# EAGLE design DHJSNoiseConsole (EAGLE 6.6.0)
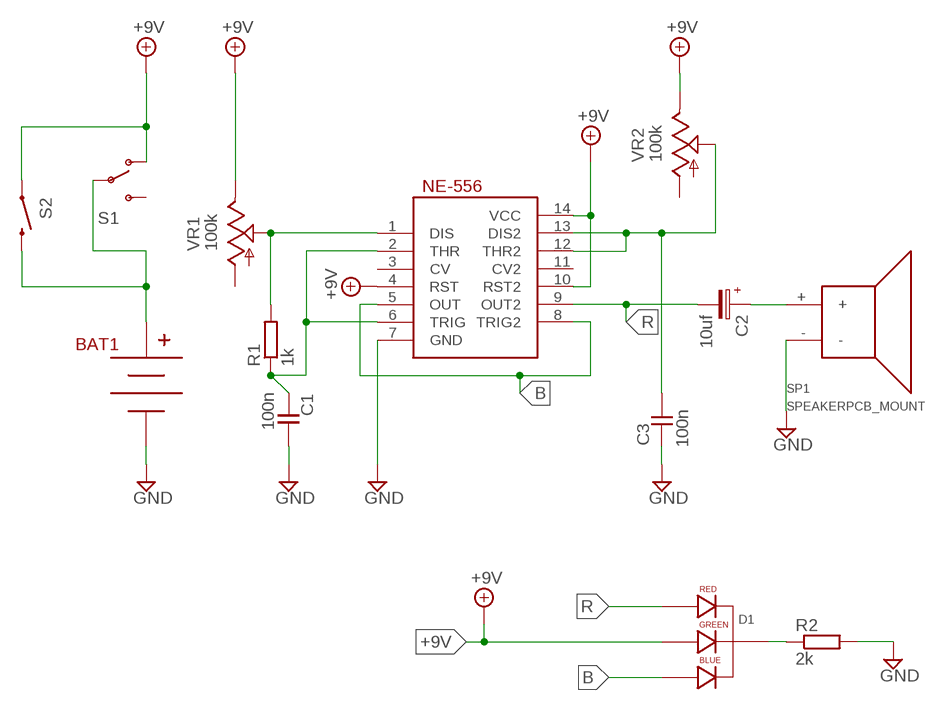
[diagram p0: schematic, sheet 1]

## Parts
BAT1  BC9VPC  [BC9VPC]
C1  100n  C-EU050-024X044  [C050-024X044]
C2  10uf  050-EU  [050_020]
C3  100n  C-EU050-024X044  [C050-024X044]
D1  LED-RGB-CC-THRUCLEAR  [LED-RGB-THRU]
NE-556  556  [DIL14]
R1  1k  RESISTOR10MM_RESISTOR  [10MM_RESISTOR]
R2  2k  RESISTOR10MM_RESISTOR  [10MM_RESISTOR]
S1  SWITCH-SPDTPTH  [SWITCH-SPDT]
S2  SWITCH-MOMENTARY-2SIDE_EZ  [TACTILE-PTH-SIDEEZ]
SP1  SPEAKERPCB_MOUNT  [PCB_MOUNT_SPEAKER]
VR1  100k  9MM_SNAP-IN_POT_  [9MM_SNAP-IN_POT]
VR2  100k  9MM_SNAP-IN_POT_  [9MM_SNAP-IN_POT]

## Nets
+9V: D1.3(GREEN_CATHODE) NE-556.4(RST) NE-556.10(RST2) NE-556.14(VCC) S1.1(O) S2.1 VR1.3(E) VR2.3(E)
B: D1.4(BLUE_CATHODE) NE-556.5(OUT) NE-556.8(TRIG2)
GND: BAT1.V- C1.1 C3.2 NE-556.7(GND) R2.2 SP1.-
N$1: NE-556.1(DIS) R1.2 VR1.2(S)
N$2: BAT1.V+ S1.2(P) S2.2
N$3: C3.1 NE-556.12(THR2) NE-556.13(DIS2) VR2.2(S)
N$4: D1.2(CATHODE) R2.1
N$6: C1.2 NE-556.2(THR) NE-556.6(TRIG) R1.1
N$7: C2.+ SP1.+
R: C2.- D1.1(RED_CATHODE) NE-556.9(OUT2)
Unconnected: NE-556.3(CV) NE-556.11(CV2) S1.3(S) VR1.1(A) VR2.1(A)

## Library data of the parts
BAT1 = SparkFun-Connectors:BC9VPC: 9V board-mount battery cradle; PROD_ID: BATT-10855
C1 C3 = TomW:C-EU: CAPACITOR, European symbol
C2 = gm-caps-electro-pol:050-EU
D1 = SparkFun-LED:LED-RGB-CC-THRU: RGB Through-hole common cathode LED SparkFun Storefront: COM-00105 (Clear) COM-09264 (Diffuse); PROD_ID: DIO-08418
NE-556 = SparkFun-AnalogIC:556: Dual timer circuit (2 555 timers in one package)
R1 R2 = MusicThingModular:RESISTOR: Standard resistor, various versions
S1 = SparkFun-Electromechanical:SWITCH-SPDT: SPDT Switch Simple slide switch, Spark Fun Electronics SKU : COM-00102 DPDT SMT slide switch, AYZ0202, SWCH-08179
S2 = SparkFun-Electromechanical:SWITCH-MOMENTARY-2: Various NO switches- pushbuttons, reed, etc
SP1 = SparkFun-Electromechanical:SPEAKER: General speakers.; MFG: SANCO; PROD_#: NA; SKU: COM-11089; SPARKLE_ID: 6504
VR1 VR2 = MusicThingModular:9MM_SNAP-IN_POT: 9mm vertical snap-in pot, Alpha / Panasonic style

## Net classes
0 default: width 0.61 mm

## Board
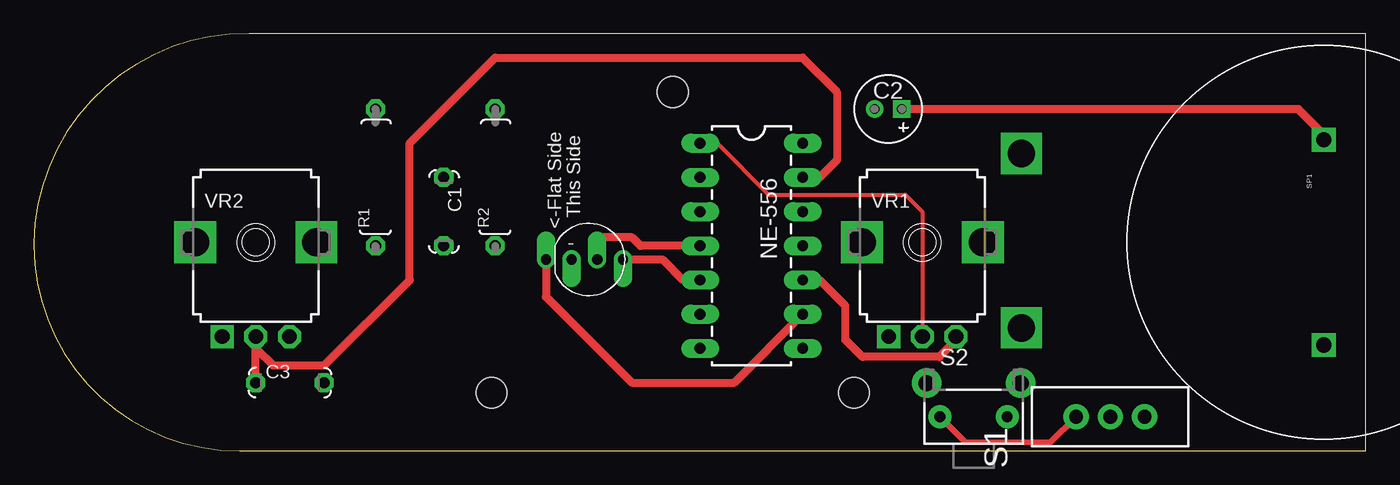
[diagram p1: board, top side]
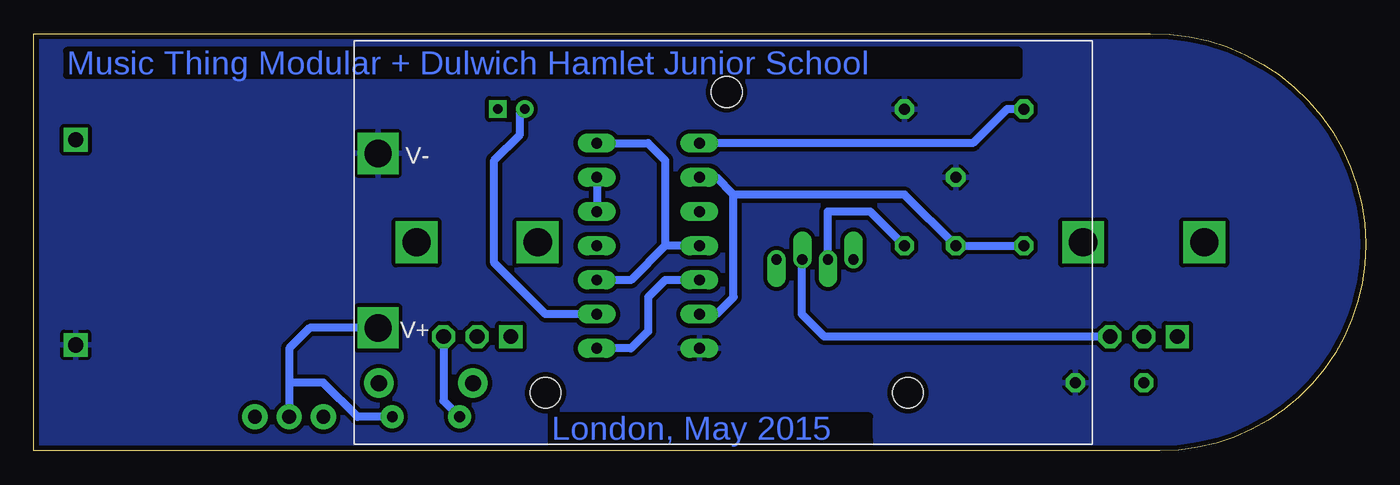
[diagram p2: board, bottom side, seen from below]

Size 99 x 31 mm. Coordinates in mm from the lower left corner, seen from the top.
Outline: 99,31 16.01,31 arc90 0,15.41 0,15.29 arc90 15.29,0 99,0 99,31
Copper layers (1*2*15*16): Top 0.035mm / dielectric 0.2mm / Route2 0.0175mm / dielectric 1.1mm / Route15 0.0175mm / dielectric 0.2mm / Bottom 0.035mm
Design rules "MT design rules rev2": minimum track width 6mil, minimum drill 12mil, track to track 12mil, track to pad 12mil, pad to pad 10mil, via to via 10mil, smd to smd 0mil, copper to edge 15mil, drill to drill 13mil, minimum pad ring 12mil, minimum via ring 6mil, stop-mask expansion 2mil, vias tented up to drill 25mil, thermal gap 10mil

### Footprints (pad centres in the part's own frame; a part is rotated, then mirrored left to right if it is on the bottom)
BC9VPC = drill 2.032 square: V+ 53.086,21.336; V- 53.086,8.382 | hole 2.286: 27.178,3.81; 13.716,26.162; 40.64,26.162
C050-024X044 = drill 0.813 octagon: 1 -2.54,0; 2 2.54,0
050_020 = drill 0.7 square: + -1,0 | drill 0.7: - 1,0
LED-RGB-THRU = drill 0.762 pad 0.889 offset: 1 3.175,0; 2 1.27,0; 3 -0.635,0; 4 -2.54,0
DIL14 = drill 0.813 long: 1 -8.89,-3.81; 2 -6.35,-3.81; 3 -3.81,-3.81; 4 -1.27,-3.81; 5 1.27,-3.81; 6 3.81,-3.81; 7 6.35,-3.81; 8 6.35,3.81; 9 3.81,3.81; 10 1.27,3.81; 11 -1.27,3.81; 12 -3.81,3.81; 13 -6.35,3.81; 14 -8.89,3.81
10MM_RESISTOR = drill 0.813 octagon: 1 -5.08,0; 2 5.08,0
SWITCH-SPDT = drill 1.016 pad 1.88: 1 0,2.54; 2 0,0; 3 0,-2.54
TACTILE-PTH-SIDEEZ = drill 0.8 pad 1.7: 1 -2.5,0; 2 2.5,0 | drill 1.2 pad 2.2: ANCHOR1 -3.5,2.5; ANCHOR2 3.5,2.5
PCB_MOUNT_SPEAKER = drill 1.143 square: + -7.62,0; - 7.62,0
9MM_SNAP-IN_POT = drill 1.1 pad 1.676 square: 1 -2.5,-7 | drill 1.1 pad 1.676 octagon: 2 0,-7; 3 2.5,-7 | drill 2.1 pad 2.8 square: M1 4.5,0; M2 -4.5,0

### Placement (x,y rotation side)
BAT1  20.32,30.48 180 bottom
C1  30.48,17.78 270 top
C2  63.5,25.4 180 top
C3  19.05,5.08 0 top
D1  41.25,14.23 180 top
NE-556  53.34,13.97 270 top
R1  25.4,20.32 90 top
R2  34.29,20.32 90 top
S1  80.01,2.54 90 top
S2  69.85,2.54 0 top
SP1  95.88,15.5 270 top
U$1  [MTM_1CM_KEEPOUT]  91.44,11.43 0 bottom
VR1  66.04,15.5 0 top
VR2  16.51,15.5 0 top

### Tracks (layer width: path | path; a pad name or v marks a point on that pad's centre or on a via)
+9V
  Top 0.406: S1.1 75.56,0.64 69.25,0.64 S2.1
  Top 0.61: NE-556.4 45.09,15.24 44.45,15.88 41.91,15.88 41.91,14.26 D1.3 | VR1.3 68.54,8.21 67.31,6.99 61.59,6.99 60.33,8.26 60.33,10.79 58.42,12.7 NE-556.10
  Bottom 0.61: VR1.3 68.54,3.73 S2.1 | NE-556.4 52.07,15.24 | 52.07,15.24 54.61,12.7 NE-556.10 | NE-556.14 53.34,22.86 52.07,21.59 52.07,15.24 | VR2.3 40.25,8.5 41.91,10.16 41.91,14.21 D1.3
B
  Top 0.61: D1.4 46.73,14.23 48.26,12.7 NE-556.5
  Bottom 0.61: NE-556.5 52.07,12.7 53.34,11.43 53.34,8.89 54.61,7.62 NE-556.8
GND
  pour Bottom: -1.27,34.29 100.33,35.56 100.33,-1.27 -1.27,-2.54
N$1
  Top 0.305: NE-556.1 50.8,22.86 54.61,19.05 64.77,19.05 66.04,17.78 VR1.2
  Bottom 0.61: R1.2 26.67,25.4 29.21,22.86 NE-556.1
N$2
  Bottom 0.61: BAT1.V+ 78.49,9.14 80.01,7.62 80.01,5.08 | 80.01,5.08 S1.2 | S2.2 74.93,2.54 77.47,5.08 80.01,5.08
N$3
  Top 0.61: C3.1 VR2.2 16.51,7.62 17.78,6.35 21.59,6.35 27.94,12.7 27.94,22.86 34.29,29.21 57.15,29.21 59.69,26.67 59.69,21.59 58.42,20.32 NE-556.13
  Bottom 0.61: NE-556.13 NE-556.12
N$4
  Bottom 0.61: R2.1 36.83,17.78 40.01,17.78 40.01,14.26 D1.2
N$6
  Bottom 0.61: NE-556.6 48.26,10.16 46.99,11.43 46.99,19.05 | 46.99,19.05 48.26,20.32 NE-556.2 | R1.1 C1.2 34.29,19.05 46.99,19.05
N$7
  Top 0.61: SP1.+ 95.88,23.5 93.98,25.4 C2.+
R
  Top 0.61: D1.1 38.08,11.46 44.45,5.08 52.07,5.08 NE-556.9
  Bottom 0.61: NE-556.9 60.96,10.16 64.77,13.97 64.77,21.59 62.87,23.5 62.87,25.04 C2.-

### Text on the board
Bottom: Music Thing Modular + Dulwich Hamlet Junior School | London, May 2015
tPlace: <-Flat Side / This Side | -
bStop: Music Thing Modular + Dulwich Hamlet Junior School | London, May 2015